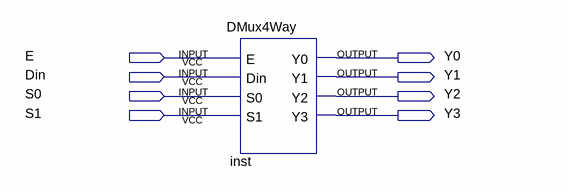
[diagram p0: schematic sheet]
// Quartus schematic Chapter4-2.bdf as structural Verilog: 1 symbols, 8 pins
module \Chapter4-2  (
  input  E,
  input  Din,
  input  S0,
  input  S1,
  output Y0,
  output Y1,
  output Y2,
  output Y3
);

  DMux4Way inst (.E(E), .Din(Din), .S0(S0), .S1(S1), .Y0(Y0), .Y1(Y1), .Y2(Y2), .Y3(Y3));
endmodule
